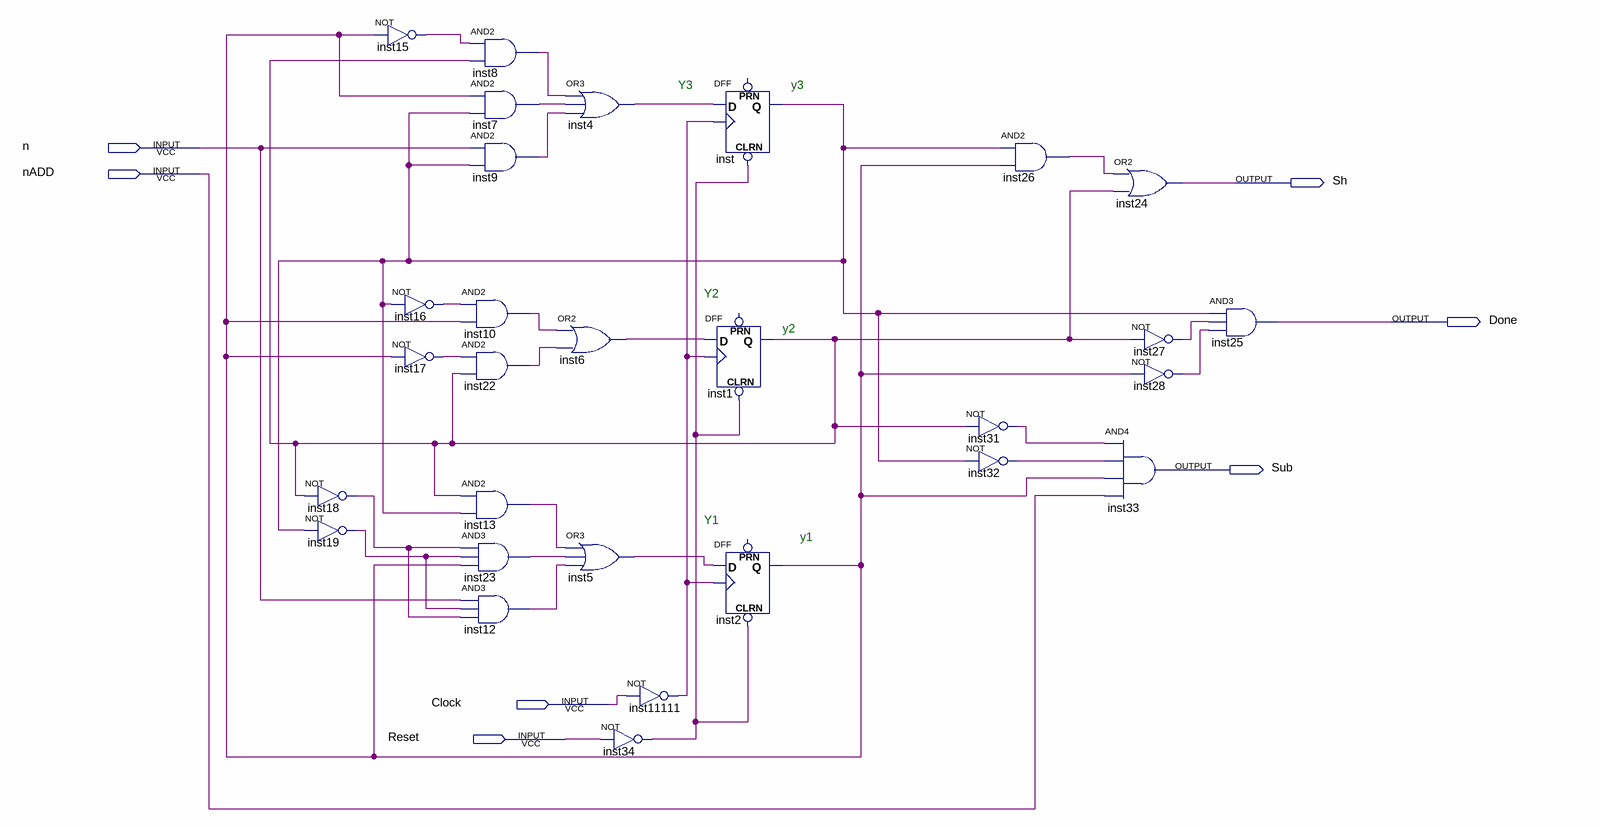
[diagram p0: schematic sheet]
// Quartus schematic Control_FSM.bdf as structural Verilog: 29 symbols, 7 pins
module Control_FSM (
  input  n,
  input  nADD,
  input  Clock,
  input  Reset,
  output Sh,
  output Done,
  output Sub
);

  wire inst1_q, inst2_q, inst4_out, inst5_out, inst6_out, inst7_out, inst8_out, inst9_out, inst10_out,
       inst12_out, inst13_out, inst15_out, inst16_out, inst17_out, inst18_out, inst19_out, inst22_out,
       inst23_out, inst26_out, inst27_out, inst28_out, inst31_out, inst32_out, inst34_out, inst11111_out,
       inst_q;

  not inst18 (inst18_out, inst1_q);
  not inst19 (inst19_out, inst_q);
  not inst15 (inst15_out, inst2_q);
  not inst16 (inst16_out, inst_q);
  not inst17 (inst17_out, inst2_q);
  and inst8 (inst8_out, inst15_out, inst1_q);
  and inst7 (inst7_out, inst2_q, inst_q);
  and inst9 (inst9_out, n, inst_q);
  and inst10 (inst10_out, inst16_out, inst2_q);
  and inst22 (inst22_out, inst17_out, inst1_q);
  and inst13 (inst13_out, inst1_q, inst_q);
  and inst23 (inst23_out, inst18_out, inst19_out, inst2_q);
  and inst12 (inst12_out, n, inst19_out, inst18_out);
  or inst4 (inst4_out, inst8_out, inst7_out, inst9_out);
  or inst6 (inst6_out, inst10_out, inst22_out);
  or inst5 (inst5_out, inst13_out, inst23_out, inst12_out);
  not inst34 (inst34_out, Reset);
  not inst11111 (inst11111_out, Clock);
  DFF inst (.CLRN(inst34_out), .CLK(inst11111_out), .D(inst4_out), .Q(inst_q));  // open: PRN
  DFF inst1 (.CLRN(inst34_out), .CLK(inst11111_out), .D(inst6_out), .Q(inst1_q));  // open: PRN
  DFF inst2 (.CLRN(inst34_out), .CLK(inst11111_out), .D(inst5_out), .Q(inst2_q));  // open: PRN
  and inst26 (inst26_out, inst_q, inst2_q);
  not inst31 (inst31_out, inst1_q);
  not inst32 (inst32_out, inst_q);
  or inst24 (Sh, inst26_out, inst1_q);
  not inst27 (inst27_out, inst1_q);
  not inst28 (inst28_out, inst2_q);
  and inst33 (Sub, inst31_out, inst32_out, inst2_q, nADD);
  and inst25 (Done, inst_q, inst27_out, inst28_out);

  // Notes on the sheet:
  //   Y3
  //   y3
  //   Y2
  //   y2
  //   Y1
  //   y1
endmodule
